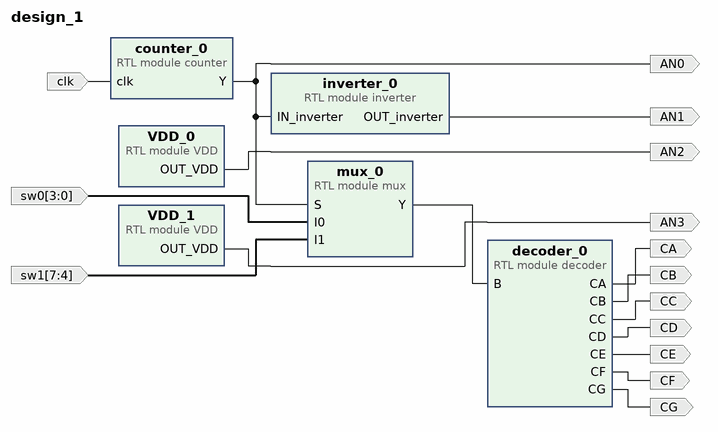
[diagram p0: block diagram of the top level]
# Vivado block design design_1, xc7z007sclg400-1, Vivado 2024.1.1
create_bd_design design_1

create_bd_port -dir I -from 7 -to 4 sw1
create_bd_port -dir I -from 3 -to 0 sw0
create_bd_port -dir I clk
create_bd_port -dir O CC
create_bd_port -dir O CA
create_bd_port -dir O CB
create_bd_port -dir O CD
create_bd_port -dir O CE
create_bd_port -dir O CF
create_bd_port -dir O CG
create_bd_port -dir O AN1
create_bd_port -dir O AN2
create_bd_port -dir O AN3
create_bd_port -dir O AN0

create_bd_cell -type module -reference counter counter_0
create_bd_cell -type module -reference mux mux_0
create_bd_cell -type module -reference inverter inverter_0
create_bd_cell -type module -reference decoder decoder_0
create_bd_cell -type module -reference VDD VDD_0
create_bd_cell -type module -reference VDD VDD_1

# ---- connections ----

connect_bd_net [get_bd_pins VDD_0/OUT_VDD] [get_bd_ports AN2]
connect_bd_net [get_bd_pins VDD_1/OUT_VDD] [get_bd_ports AN3]
connect_bd_net [get_bd_ports clk] [get_bd_pins counter_0/clk]
connect_bd_net [get_bd_pins counter_0/Y] [get_bd_pins mux_0/S] [get_bd_pins inverter_0/IN_inverter] [get_bd_ports AN0]
connect_bd_net [get_bd_pins decoder_0/CA] [get_bd_ports CA]
connect_bd_net [get_bd_pins decoder_0/CB] [get_bd_ports CB]
connect_bd_net [get_bd_pins decoder_0/CC] [get_bd_ports CC]
connect_bd_net [get_bd_pins decoder_0/CD] [get_bd_ports CD]
connect_bd_net [get_bd_pins decoder_0/CE] [get_bd_ports CE]
connect_bd_net [get_bd_pins decoder_0/CF] [get_bd_ports CF]
connect_bd_net [get_bd_pins decoder_0/CG] [get_bd_ports CG]
connect_bd_net [get_bd_pins inverter_0/OUT_inverter] [get_bd_ports AN1]
connect_bd_net [get_bd_pins mux_0/Y] [get_bd_pins decoder_0/B]
connect_bd_net -net sw0_1 [get_bd_ports sw0] [get_bd_pins mux_0/I0]
connect_bd_net -net sw1_1 [get_bd_ports sw1] [get_bd_pins mux_0/I1]

validate_bd_design
save_bd_design
